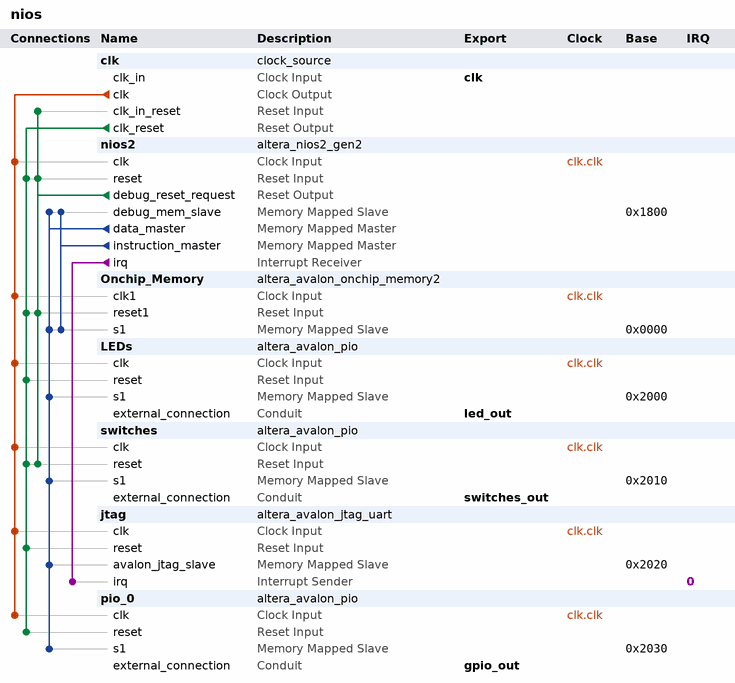
[diagram p0: system contents]
# Platform Designer (Qsys) system nios, Cyclone IV E EP4CE115F29C7
# Parameters at their usual value, and those the tool derives, are not listed.
package require -exact qsys 15.1
create_system nios
set_project_property DEVICE_FAMILY {Cyclone IV E}
set_project_property DEVICE EP4CE115F29C7

add_instance clk clock_source 15.1
set_instance_parameter_value clk clockFrequency 50000000

add_instance nios2 altera_nios2_gen2 15.1
set_instance_parameter_value nios2 dcache_size 2048
set_instance_parameter_value nios2 exceptionSlave Onchip_Memory.s1
set_instance_parameter_value nios2 icache_size 4096
set_instance_parameter_value nios2 impl Tiny
set_instance_parameter_value nios2 resetSlave Onchip_Memory.s1

add_instance Onchip_Memory altera_avalon_onchip_memory2 15.1
set_instance_parameter_value Onchip_Memory dataWidth 32
set_instance_parameter_value Onchip_Memory dualPort false
set_instance_parameter_value Onchip_Memory initMemContent true
set_instance_parameter_value Onchip_Memory initializationFileName onchip_mem.hex
set_instance_parameter_value Onchip_Memory memorySize 4096
set_instance_parameter_value Onchip_Memory writable false

add_instance LEDs altera_avalon_pio 15.1
set_instance_parameter_value LEDs direction Output
set_instance_parameter_value LEDs width 8

add_instance switches altera_avalon_pio 15.1
set_instance_parameter_value switches direction Input
set_instance_parameter_value switches width 8

add_instance jtag altera_avalon_jtag_uart 15.1
set_instance_parameter_value jtag simInteractiveOptions NO_INTERACTIVE_WINDOWS
set_instance_parameter_value jtag writeIRQThreshold 5

add_instance pio_0 altera_avalon_pio 15.1
set_instance_parameter_value pio_0 direction Output
set_instance_parameter_value pio_0 width 8

# connections
add_connection clk.clk jtag.clk clock
add_connection clk.clk LEDs.clk clock
add_connection clk.clk nios2.clk clock
add_connection clk.clk Onchip_Memory.clk1 clock
add_connection clk.clk pio_0.clk clock
add_connection clk.clk switches.clk clock
add_connection clk.clk_reset jtag.reset reset
add_connection clk.clk_reset LEDs.reset reset
add_connection clk.clk_reset nios2.reset reset
add_connection clk.clk_reset Onchip_Memory.reset1 reset
add_connection clk.clk_reset pio_0.reset reset
add_connection clk.clk_reset switches.reset reset
add_connection nios2.debug_reset_request clk.clk_in_reset reset
add_connection nios2.debug_reset_request nios2.reset reset
add_connection nios2.debug_reset_request Onchip_Memory.reset1 reset
add_connection nios2.debug_reset_request switches.reset reset
add_connection nios2.data_master jtag.avalon_jtag_slave avalon
set_connection_parameter_value nios2.data_master/jtag.avalon_jtag_slave baseAddress 0x2020
add_connection nios2.data_master LEDs.s1 avalon
set_connection_parameter_value nios2.data_master/LEDs.s1 baseAddress 0x2000
add_connection nios2.data_master nios2.debug_mem_slave avalon
set_connection_parameter_value nios2.data_master/nios2.debug_mem_slave baseAddress 0x1800
add_connection nios2.data_master Onchip_Memory.s1 avalon
set_connection_parameter_value nios2.data_master/Onchip_Memory.s1 baseAddress 0x0000
add_connection nios2.data_master pio_0.s1 avalon
set_connection_parameter_value nios2.data_master/pio_0.s1 baseAddress 0x2030
add_connection nios2.data_master switches.s1 avalon
set_connection_parameter_value nios2.data_master/switches.s1 baseAddress 0x2010
add_connection nios2.instruction_master nios2.debug_mem_slave avalon
set_connection_parameter_value nios2.instruction_master/nios2.debug_mem_slave baseAddress 0x1800
add_connection nios2.instruction_master Onchip_Memory.s1 avalon
set_connection_parameter_value nios2.instruction_master/Onchip_Memory.s1 baseAddress 0x0000
add_connection nios2.irq jtag.irq interrupt
set_connection_parameter_value nios2.irq/jtag.irq irqNumber 0

# exported interfaces
add_interface clk clock sink
set_interface_property clk EXPORT_OF clk.clk_in
add_interface gpio_out conduit end
set_interface_property gpio_out EXPORT_OF pio_0.external_connection
add_interface led_out conduit end
set_interface_property led_out EXPORT_OF LEDs.external_connection
add_interface switches_out conduit end
set_interface_property switches_out EXPORT_OF switches.external_connection

set_interconnect_requirement {$system} qsys_mm.clockCrossingAdapter HANDSHAKE
set_interconnect_requirement {$system} qsys_mm.enableEccProtection FALSE
set_interconnect_requirement {$system} qsys_mm.insertDefaultSlave FALSE
set_interconnect_requirement {$system} qsys_mm.maxAdditionalLatency 1

save_system nios.qsys
